# Altium schematic sheet Controller.SchDoc
size B; ENG_APP_DATE: --/--/--; DSN_APP_DATE: --/--/--; CHK_APP_DATE: --/--/--; Organization: My Company; Address1: Address Line 1; Address2: Address Line 2; Address3: Address Line 3; Address4: Address Line 4; SheetNumber: 3; SheetTotal: 5
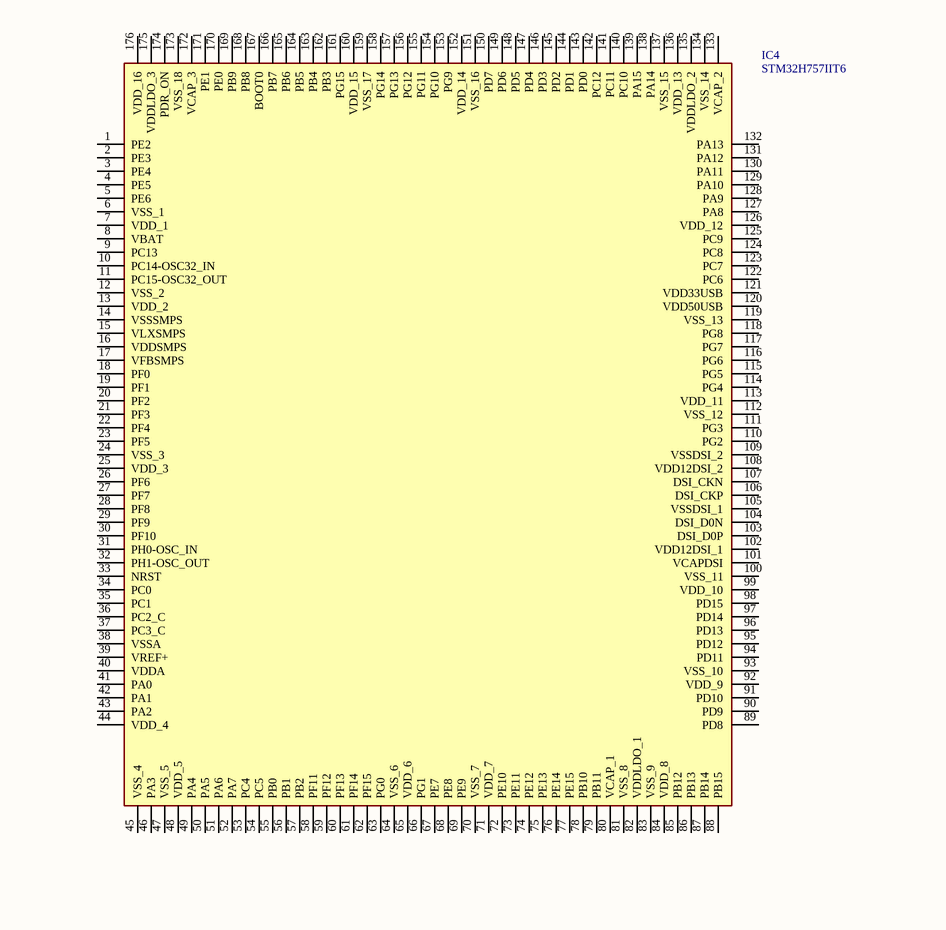
[diagram p0: Controller.SchDoc, top]
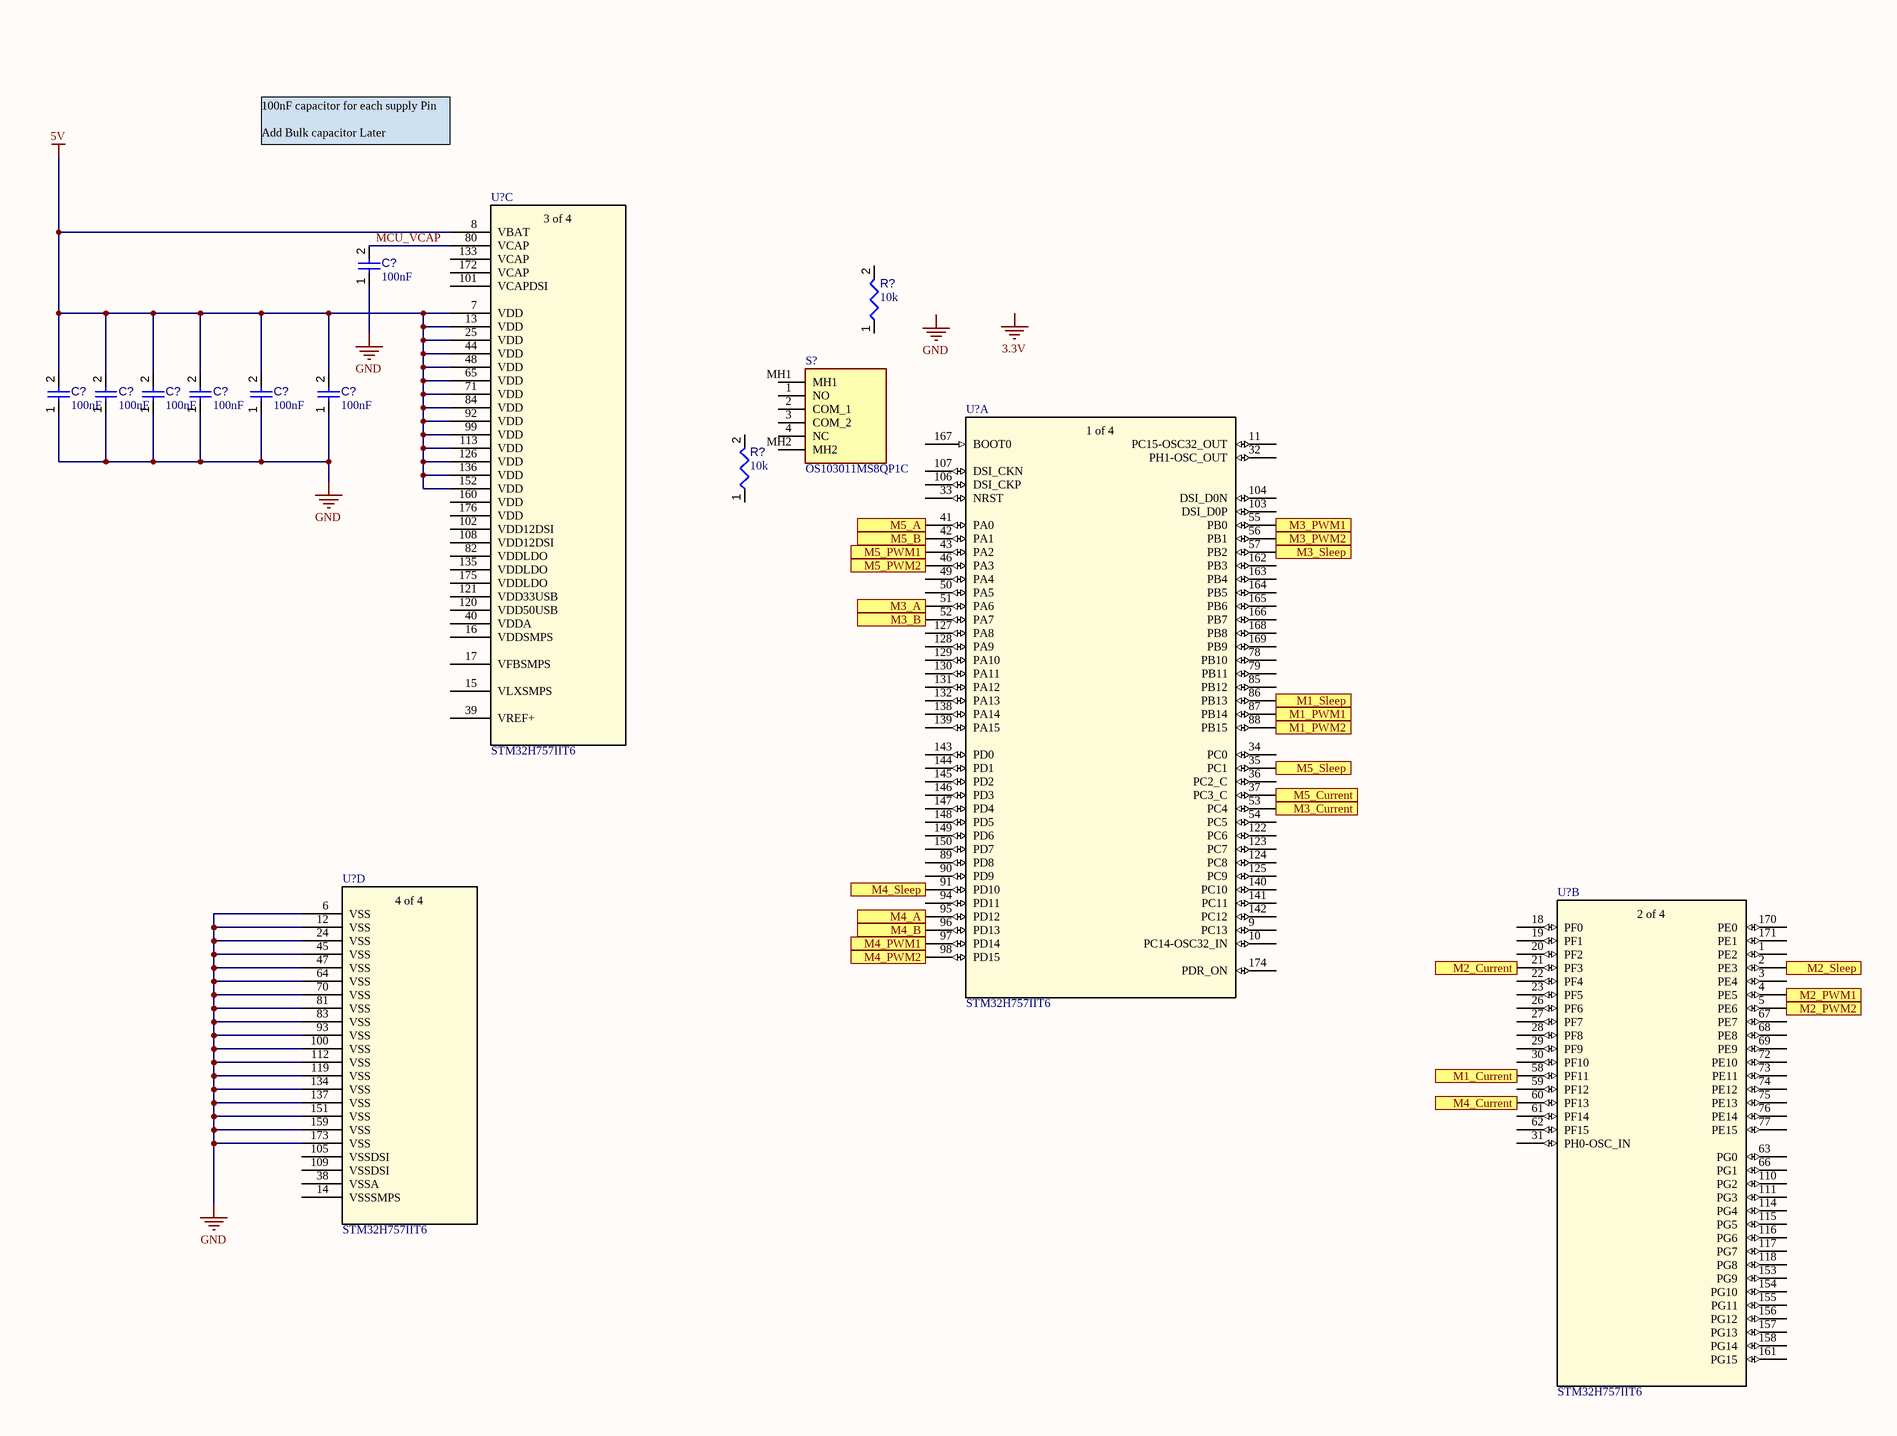
[diagram p1: Controller.SchDoc, bottom]

## Parts
(Parts that share a designator on the sheet are numbered #1, #2 ... from top to bottom, then left to right.)
C?#1  value 100nF  [CAPC2013X95X50LL10T25]  (hidden comment: Capacitor 100 nF +/-10% 50 V 0805)
C?#2  value 100nF  [CAPC2013X95X50LL10T25]  (hidden comment: Capacitor 100 nF +/-10% 50 V 0805)
C?#3  value 100nF  [CAPC2013X95X50LL10T25]  (hidden comment: Capacitor 100 nF +/-10% 50 V 0805)
C?#4  value 100nF  [CAPC2013X95X50LL10T25]  (hidden comment: Capacitor 100 nF +/-10% 50 V 0805)
C?#5  value 100nF  [CAPC2013X95X50LL10T25]  (hidden comment: Capacitor 100 nF +/-10% 50 V 0805)
C?#6  value 100nF  [CAPC2013X95X50LL10T25]  (hidden comment: Capacitor 100 nF +/-10% 50 V 0805)
C?#7  value 100nF  [CAPC2013X95X50LL10T25]  (hidden comment: Capacitor 100 nF +/-10% 50 V 0805)
IC4  STM32H757IIT6  [QFP50P2600X2600X160-176N]
R?#1  value 10k  [RESC3216X60X45ML15T20]  (hidden comment: Resistor 10k +/-1% 1206 250 mW)
R?#2  value 10k  [RESC3216X60X45ML15T20]  (hidden comment: Resistor 10k +/-1% 1206 250 mW)
S?  OS103011MS8QP1C  [OS103011MS8QP1C]
U?#1  STM32H757IIT6  [LQFP-176]  (part C of 4)
U?#2  STM32H757IIT6  [LQFP-176]  (part A of 4)
U?#3  STM32H757IIT6  [LQFP-176]  (part D of 4)
U?#4  STM32H757IIT6  [LQFP-176]  (part B of 4)

## Ports
M1_Current (in), M1_PWM1 (out), M1_PWM2 (out), M1_Sleep (out), M2_Current (in), M2_PWM1 (out), M2_PWM2 (out), M2_Sleep (out), M3_A (in), M3_B (in), M3_Current (in), M3_PWM1 (out), M3_PWM2 (out), M3_Sleep (out), M4_A (in), M4_B (in), M4_Current (in), M4_PWM1 (out), M4_PWM2 (out), M4_Sleep (out), M5_A (in), M5_B (in), M5_Current (in), M5_PWM1 (out), M5_PWM2 (out), M5_Sleep (out)

## Nets
5V: C?#2.2 C?#3.2 C?#4.2 C?#5.2 C?#6.2 C?#7.2 U?#1.7(VDD) U?#1.8(VBAT) U?#1.13(VDD) U?#1.25(VDD) U?#1.44(VDD) U?#1.48(VDD) U?#1.65(VDD) U?#1.71(VDD) U?#1.84(VDD) U?#1.92(VDD) U?#1.99(VDD) U?#1.113(VDD) U?#1.126(VDD) U?#1.136(VDD) U?#1.152(VDD)
GND: C?#1.1 C?#2.1 C?#3.1 C?#4.1 C?#5.1 C?#6.1 C?#7.1 U?#3.6(VSS) U?#3.12(VSS) U?#3.24(VSS) U?#3.45(VSS) U?#3.47(VSS) U?#3.64(VSS) U?#3.70(VSS) U?#3.81(VSS) U?#3.83(VSS) U?#3.93(VSS) U?#3.100(VSS) U?#3.112(VSS) U?#3.119(VSS) U?#3.134(VSS) U?#3.137(VSS) U?#3.151(VSS) U?#3.159(VSS) U?#3.173(VSS)
M1_Current: U?#4.58(PF11) ; port M1_Current
M1_PWM1: U?#2.87(PB14) ; port M1_PWM1
M1_PWM2: U?#2.88(PB15) ; port M1_PWM2
M1_Sleep: U?#2.86(PB13) ; port M1_Sleep
M2_Current: U?#4.21(PF3) ; port M2_Current
M2_PWM1: U?#4.4(PE5) ; port M2_PWM1
M2_PWM2: U?#4.5(PE6) ; port M2_PWM2
M2_Sleep: U?#4.2(PE3) ; port M2_Sleep
M3_A: U?#2.51(PA6) ; port M3_A
M3_B: U?#2.52(PA7) ; port M3_B
M3_Current: U?#2.53(PC4) ; port M3_Current
M3_PWM1: U?#2.55(PB0) ; port M3_PWM1
M3_PWM2: U?#2.56(PB1) ; port M3_PWM2
M3_Sleep: U?#2.57(PB2) ; port M3_Sleep
M4_A: U?#2.95(PD12) ; port M4_A
M4_B: U?#2.96(PD13) ; port M4_B
M4_Current: U?#4.60(PF13) ; port M4_Current
M4_PWM1: U?#2.97(PD14) ; port M4_PWM1
M4_PWM2: U?#2.98(PD15) ; port M4_PWM2
M4_Sleep: U?#2.91(PD10) ; port M4_Sleep
M5_A: U?#2.41(PA0) ; port M5_A
M5_B: U?#2.42(PA1) ; port M5_B
M5_Current: U?#2.37(PC3_C) ; port M5_Current
M5_PWM1: U?#2.43(PA2) ; port M5_PWM1
M5_PWM2: U?#2.46(PA3) ; port M5_PWM2
M5_Sleep: U?#2.35(PC1) ; port M5_Sleep
MCU_VCAP: C?#1.2 U?#1.80(VCAP)

Not connected (* = marked no-connect by the designer): IC4 1(PE2) 2(PE3) 3(PE4) 4(PE5) 5(PE6) 6(VSS_1) 7(VDD_1) 8(VBAT) 9(PC13) 10(PC14-OSC32_IN) 11(PC15-OSC32_OUT) 12(VSS_2) 13(VDD_2) 14(VSSSMPS) 15(VLXSMPS) 16(VDDSMPS) 17(VFBSMPS) 18(PF0) 19(PF1) 20(PF2) 21(PF3) 22(PF4) 23(PF5) 24(VSS_3) 25(VDD_3) 26(PF6) 27(PF7) 28(PF8) 29(PF9) 30(PF10) 31(PH0-OSC_IN) 32(PH1-OSC_OUT) 33(NRST) 34(PC0) 35(PC1) 36(PC2_C) 37(PC3_C) 38(VSSA) 39(VREF+) 40(VDDA) 41(PA0) 42(PA1) 43(PA2) 44(VDD_4) 45(VSS_4) 46(PA3) 47(VSS_5) 48(VDD_5) 49(PA4) 50(PA5) 51(PA6) 52(PA7) 53(PC4) 54(PC5) 55(PB0) 56(PB1) 57(PB2) 58(PF11) 59(PF12) 60(PF13) 61(PF14) 62(PF15) 63(PG0) 64(VSS_6) 65(VDD_6) 66(PG1) 67(PE7) 68(PE8) 69(PE9) 70(VSS_7) 71(VDD_7) 72(PE10) 73(PE11) 74(PE12) 75(PE13) 76(PE14) 77(PE15) 78(PB10) 79(PB11) 80(VCAP_1) 81(VSS_8) 82(VDDLDO_1) 83(VSS_9) 84(VDD_8) 85(PB12) 86(PB13) 87(PB14) 88(PB15) 89(PD8) 90(PD9) 91(PD10) 92(VDD_9) 93(VSS_10) 94(PD11) 95(PD12) 96(PD13) 97(PD14) 98(PD15) 99(VDD_10) 100(VSS_11) 101(VCAPDSI) 102(VDD12DSI_1) 103(DSI_D0P) 104(DSI_D0N) 105(VSSDSI_1) 106(DSI_CKP) 107(DSI_CKN) 108(VDD12DSI_2) 109(VSSDSI_2) 110(PG2) 111(PG3) 112(VSS_12) 113(VDD_11) 114(PG4) 115(PG5) 116(PG6) 117(PG7) 118(PG8) 119(VSS_13) 120(VDD50USB) 121(VDD33USB) 122(PC6) 123(PC7) 124(PC8) 125(PC9) 126(VDD_12) 127(PA8) 128(PA9) 129(PA10) 130(PA11) 131(PA12) 132(PA13) 133(VCAP_2) 134(VSS_14) 135(VDDLDO_2) 136(VDD_13) 137(VSS_15) 138(PA14) 139(PA15) 140(PC10) 141(PC11) 142(PC12) 143(PD0) 144(PD1) 145(PD2) 146(PD3) 147(PD4) 148(PD5) 149(PD6) 150(PD7) 151(VSS_16) 152(VDD_14) 153(PG9) 154(PG10) 155(PG11) 156(PG12) 157(PG13) 158(PG14) 159(VSS_17) 160(VDD_15) 161(PG15) 162(PB3) 163(PB4) 164(PB5) 165(PB6) 166(PB7) 167(BOOT0) 168(PB8) 169(PB9) 170(PE0) 171(PE1) 172(VCAP_3) 173(VSS_18) 174(PDR_ON) 175(VDDLDO_3) 176(VDD_16); R?#1 1 2; R?#2 1 2; S? 1(NO) 2(COM_1) 3(COM_2) 4(NC) MH1 MH2; U?#1 15(VLXSMPS) 16(VDDSMPS) 17(VFBSMPS) 39(VREF+) 40(VDDA) 82(VDDLDO) 101(VCAPDSI) 102(VDD12DSI) 108(VDD12DSI) 120(VDD50USB) 121(VDD33USB) 133(VCAP) 135(VDDLDO) 160(VDD) 172(VCAP) 175(VDDLDO) 176(VDD); U?#2 9(PC13) 10(PC14-OSC32_IN) 11(PC15-OSC32_OUT) 32(PH1-OSC_OUT) 33(NRST) 34(PC0) 36(PC2_C) 49(PA4) 50(PA5) 54(PC5) 78(PB10) 79(PB11) 85(PB12) 89(PD8) 90(PD9) 94(PD11) 103(DSI_D0P) 104(DSI_D0N) 106(DSI_CKP) 107(DSI_CKN) 122(PC6) 123(PC7) 124(PC8) 125(PC9) 127(PA8) 128(PA9) 129(PA10) 130(PA11) 131(PA12) 132(PA13) 138(PA14) 139(PA15) 140(PC10) 141(PC11) 142(PC12) 143(PD0) 144(PD1) 145(PD2) 146(PD3) 147(PD4) 148(PD5) 149(PD6) 150(PD7) 162(PB3) 163(PB4) 164(PB5) 165(PB6) 166(PB7) 167(BOOT0) 168(PB8) 169(PB9) 174(PDR_ON); U?#3 14(VSSSMPS) 38(VSSA) 105(VSSDSI) 109(VSSDSI); U?#4 1(PE2) 3(PE4) 18(PF0) 19(PF1) 20(PF2) 22(PF4) 23(PF5) 26(PF6) 27(PF7) 28(PF8) 29(PF9) 30(PF10) 31(PH0-OSC_IN) 59(PF12) 61(PF14) 62(PF15) 63(PG0) 66(PG1) 67(PE7) 68(PE8) 69(PE9) 72(PE10) 73(PE11) 74(PE12) 75(PE13) 76(PE14) 77(PE15) 110(PG2) 111(PG3) 114(PG4) 115(PG5) 116(PG6) 117(PG7) 118(PG8) 153(PG9) 154(PG10) 155(PG11) 156(PG12) 157(PG13) 158(PG14) 161(PG15) 170(PE0) 171(PE1)

## Notes on the sheet
- 100nF capacitor for each supply Pin
  Add Bulk capacitor Later
- Labels drawn without touching a wire or pin: 3.3V, GND
- Title:
- Size:
- Engineer:
- Revision:
- Date:
- B
- Time Edited:
- Sheet
- of
- File:
- (in symbol STM32H757IIT6, part A) 1 of 4
- (in symbol STM32H757IIT6, part B) 2 of 4
- (in symbol STM32H757IIT6, part C) 3 of 4
- (in symbol STM32H757IIT6, part D) 4 of 4

## Library data of the parts
C?#1-C?#7 = CMP-001-00018-6: Chip Capacitor, 100 nF, +/- 10%, 50 V, 0805 (2012 Metric); Capacitor Type: Ceramic; Voltage Rating: 50V; Pins: 2; Max Operating Temperature: 125°C; Min Operating Temperature: -55°C; Mounting Technology: SM; Case/Package: 0805; RoHS Compliant: True; Tolerance: 10%
IC4 = STM32H757IIT6: Integrated Circuit; Manufacturer_Name: STMicroelectronics; Datasheet Link: https://www.st.com/resource/en/datasheet/stm32h757ai.pdf; Height: 1.6mm; Manufacturer_Part_Number: STM32H757IIT6; Mouser Part Number: 511-STM32H757IIT6; Mouser Price/Stock: https://www.mouser.co.uk/ProductDetail/STMicroelectronics/STM32H757IIT6?qs=vLWxofP3U2wz9EzH5pjPxQ%3D%3D; Arrow Part Number: STM32H757IIT6; Arrow Price/Stock: https://www.arrow.com/en/products/stm32h757iit6/stmicroelectronics?region=nac
R?#1 R?#2 = CMP-009-00016-5: Chip Resistor, 10 KOhm, +/- 1%, 0.25 W, -55 to 155 degC, 1206 (3216 Metric); Power: 250mW; Voltage Rating: 200V; Pins: 2; Max Operating Temperature: 155°C; Tolerance: 1%; RoHS Compliant: True; Case/Package: 1206; Min Operating Temperature: -55°C; Mounting Technology: SM
S? = OS103011MS8QP1C: Switch; Manufacturer_Name: C & K COMPONENTS; Datasheet Link: https://www.mouser.com/datasheet/2/60/os-1382783.pdf; Height: 8.7mm; Manufacturer_Part_Number: OS103011MS8QP1C; Mouser Part Number: 611-OS103011MS8QP1C; Mouser Price/Stock: https://www.mouser.co.uk/ProductDetail/CK/OS103011MS8QP1C?qs=RHLK7eRW6AERXHXtlIQZ1Q%3D%3D; Arrow Part Number: OS103011MS8QP1C; Arrow Price/Stock: https://www.arrow.com/en/products/os103011ms8qp1c/ck?region=europe
U?#1-U?#4 = STM32H757IIT6: No Description Available; Mfr_Name: STMicroelectronics; RefDes: RefDes; Type: Type
  U?#2: ComponentLink1Description: Datasheet Link; ComponentLink1URL: https://www.st.com/resource/en/datasheet/stm32h757ai.pdf